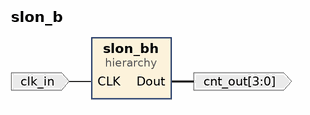
[diagram p0: block diagram of the top level]
# Vivado block design slon_b, xc7a35ticsg324-1L, Vivado 2016.3_sdx
create_bd_design slon_b

create_bd_port -dir I clk_in
create_bd_port -dir O -from 3 -to 0 cnt_out

create_bd_cell -type hier slon_bh

# ---- hierarchy /slon_bh ----
current_bd_instance /slon_bh
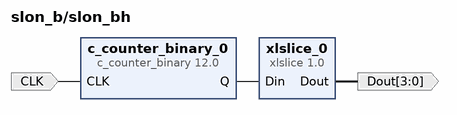
[diagram p1: block diagram inside /slon_bh]
create_bd_pin -dir I -type clk CLK
create_bd_pin -dir O -from 3 -to 0 Dout

create_bd_cell -type ip -vlnv xilinx.com:ip:c_counter_binary:12.0 c_counter_binary_0
set_property -dict {CONFIG.Output_Width 24} [get_bd_cells c_counter_binary_0]
create_bd_cell -type ip -vlnv xilinx.com:ip:xlslice:1.0 xlslice_0
set_property -dict {CONFIG.DOUT_WIDTH 4 CONFIG.DIN_TO 20 CONFIG.DIN_FROM 23 CONFIG.DIN_WIDTH 24} [get_bd_cells xlslice_0]

# ---- connections ----

current_bd_instance /slon_bh
connect_bd_net [get_bd_pins c_counter_binary_0/Q] [get_bd_pins xlslice_0/Din]
connect_bd_net [get_bd_pins CLK] [get_bd_pins c_counter_binary_0/CLK]
connect_bd_net [get_bd_pins xlslice_0/Dout] [get_bd_pins Dout]

current_bd_instance /
connect_bd_net [get_bd_ports clk_in] [get_bd_pins slon_bh/CLK]
connect_bd_net [get_bd_pins slon_bh/Dout] [get_bd_ports cnt_out]

validate_bd_design
save_bd_design
